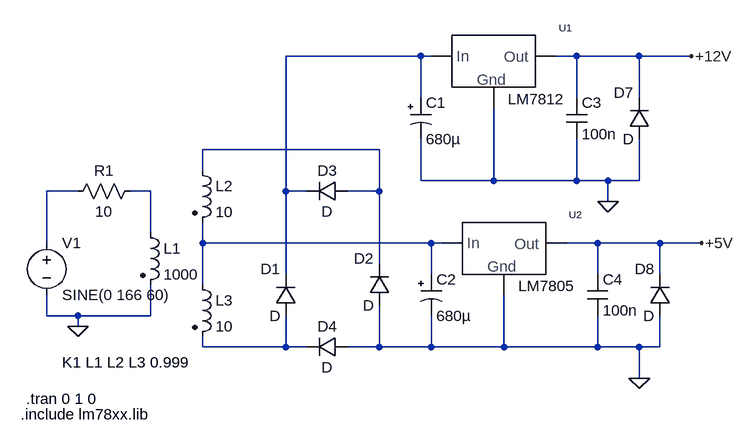
[diagram p0: schematic powersupply.asc]
powersupply.asc, the LTspice schematic file:
Version 4
SHEET 1 1688 680
WIRE 528 -192 320 -192
WIRE 544 -192 528 -192
WIRE 768 -192 736 -192
WIRE 864 -192 768 -192
WIRE 944 -192 864 -192
WIRE 528 -128 528 -192
WIRE 768 -128 768 -192
WIRE 864 -128 864 -192
WIRE 464 -48 192 -48
WIRE 192 -16 192 -48
WIRE 528 0 528 -64
WIRE 640 0 640 -112
WIRE 640 0 528 0
WIRE 768 0 768 -64
WIRE 768 0 640 0
WIRE 816 0 768 0
WIRE 864 0 864 -64
WIRE 864 0 816 0
WIRE 0 16 -48 16
WIRE 112 16 80 16
WIRE 320 16 320 -192
WIRE 352 16 320 16
WIRE 464 16 464 -48
WIRE 464 16 416 16
WIRE 816 32 816 0
WIRE 112 80 112 16
WIRE -48 96 -48 16
WIRE 192 96 192 64
WIRE 544 96 192 96
WIRE 560 96 544 96
WIRE 800 96 752 96
WIRE 896 96 800 96
WIRE 960 96 896 96
WIRE 464 128 464 16
WIRE 320 144 320 16
WIRE 544 144 544 96
WIRE 800 144 800 96
WIRE 896 144 896 96
WIRE 192 160 192 96
WIRE -48 208 -48 176
WIRE 0 208 -48 208
WIRE 112 208 112 160
WIRE 112 208 0 208
WIRE 0 224 0 208
WIRE 192 256 192 240
WIRE 320 256 320 208
WIRE 320 256 192 256
WIRE 352 256 320 256
WIRE 464 256 464 192
WIRE 464 256 416 256
WIRE 544 256 544 208
WIRE 544 256 464 256
WIRE 656 256 656 176
WIRE 656 256 544 256
WIRE 800 256 800 208
WIRE 800 256 656 256
WIRE 864 256 800 256
WIRE 896 256 896 208
WIRE 896 256 864 256
WIRE 864 304 864 256
FLAG 0 224 0
FLAG 864 304 0
FLAG 816 32 0
FLAG 944 -192 +12V
FLAG 960 96 +5V
SYMBOL ind2 96 64 R0
SYMATTR InstName L1
SYMATTR Value 1000
SYMATTR Type ind
SYMBOL ind2 176 -32 R0
SYMATTR InstName L2
SYMATTR Value 10
SYMATTR Type ind
SYMBOL ind2 176 144 R0
SYMATTR InstName L3
SYMATTR Value 10
SYMATTR Type ind
SYMBOL voltage -48 80 R0
WINDOW 123 0 0 Left 0
WINDOW 39 0 0 Left 0
SYMATTR InstName V1
SYMATTR Value SINE(0 166 60)
SYMBOL diode 336 208 R180
WINDOW 0 24 72 Left 0
WINDOW 3 24 0 Left 0
SYMATTR InstName D1
SYMBOL diode 480 192 R180
WINDOW 0 24 72 Left 0
WINDOW 3 24 0 Left 0
SYMATTR InstName D2
SYMBOL diode 416 0 R90
WINDOW 0 0 32 VBottom 0
WINDOW 3 32 32 VTop 0
SYMATTR InstName D3
SYMBOL diode 416 240 R90
WINDOW 0 0 32 VBottom 0
WINDOW 3 32 32 VTop 0
SYMATTR InstName D4
SYMBOL res 96 0 R90
WINDOW 0 0 56 VBottom 0
WINDOW 3 32 56 VTop 0
SYMATTR InstName R1
SYMATTR Value 10
SYMBOL polcap 512 -128 R0
WINDOW 3 24 64 Left 0
SYMATTR Value 680µ
SYMATTR InstName C1
SYMATTR Description Capacitor
SYMATTR Type cap
SYMATTR SpiceLine V=50 Irms=210m Rser=0.45 Lser=0
SYMBOL vreg 640 -176 R0
SYMATTR Value LM7812
SYMATTR InstName U1
SYMBOL polcap 528 144 R0
WINDOW 3 24 64 Left 0
SYMATTR Value 680µ
SYMATTR InstName C2
SYMATTR Description Capacitor
SYMATTR Type cap
SYMATTR SpiceLine V=50 Irms=210m Rser=0.45 Lser=0
SYMBOL diode 880 -64 R180
WINDOW 0 24 72 Left 0
WINDOW 3 24 0 Left 0
SYMATTR InstName D7
SYMBOL diode 912 208 R180
WINDOW 0 24 72 Left 0
WINDOW 3 24 0 Left 0
SYMATTR InstName D8
SYMBOL cap 752 -128 R0
SYMATTR InstName C3
SYMATTR Value 100n
SYMBOL cap 784 144 R0
SYMATTR InstName C4
SYMATTR Value 100n
SYMBOL vreg 656 112 R0
SYMATTR Value LM7805
SYMATTR InstName U2
TEXT -24 280 Left 0 !K1 L1 L2 L3 0.999
TEXT -80 336 Left 0 !.tran 0 1 0
TEXT -88 360 Left 0 !.include lm78xx.lib

The netlist it stands for:
* powersupply.asc
L1 N004 0 1000
L2 N002 N005 10
L3 N005 N006 10
V1 N003 0 SINE(0 166 60)
D1 N006 N001 D
D2 0 N002 D
D3 N002 N001 D
D4 0 N006 D
R1 N004 N003 10
C1 N001 0 680µ V=50 Irms=210m Rser=0.45 Lser=0
XU1 N001 0 +12V LM7812
C2 N005 0 680µ V=50 Irms=210m Rser=0.45 Lser=0
D7 0 +12V D
D8 0 +5V D
C3 +12V 0 100n
C4 +5V 0 100n
XU2 N005 0 +5V LM7805
.model D D
.lib standard.dio
K1 L1 L2 L3 0.999
.tran 0 1 0
.include lm78xx.lib
.backanno
.end